# EAGLE design interface (EAGLE 7.5.0)
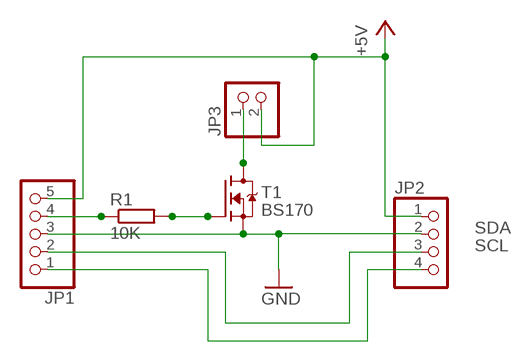
[diagram p0: schematic, sheet 1]

## Parts
JP1  PINHD-1X5  [1X05]
JP2  PINHD-1X4  [1X04]
JP3  PINHD-1X2  [1X02]
R1  10K  R-EU_R0805  [R0805]
T1  BS170  MOSFET-N-SOT23  [SOT23]

## Nets
+5V: JP1.5 JP2.1 JP3.2
GND: JP1.3 JP2.2 T1.2(S)
N$1: JP1.4 R1.1
N$2: R1.2 T1.1(G)
N$3: JP3.1 T1.3(D)
N$6: JP1.2 JP2.3
N$7: JP1.1 JP2.4

## Notes on the sheet
- SDA
- SCL

## Library data of the parts
JP1 = pinhead:PINHD-1X5: PIN HEADER
JP2 = pinhead:PINHD-1X4: PIN HEADER
JP3 = pinhead:PINHD-1X2: PIN HEADER
R1 = rcl:R-EU_: RESISTOR, European symbol
T1 = we-transistor:MOSFET-N: N-Channel MOSFET SOT23 N-Chn MOSFET TSM3404, IRLML2502 (Vgs>=+/-20V, Vds<=20V, Id>=3A + Rds<=0.05Ohm @ Vgs=4.5V) BSS138 (Vgs>=+/-20V, Vds<=40V, Id>=0.2A + Rds<=3Ohm @ Vgs=4.5V) SOT223 Low Side Switch with Protection (Infineon) BSP76 (Vin=0...10V, Vds<=42V, Id=1.4A + Rds=0.2Ohm @ Vin=5V) BSP77 (Vin=0...10V, Vds<=42V, Id=2.2A + Rds=0.1Ohm @ Vin=5V) D²Pak Low Side Switch with Protection (Infineon) BTS117TC (Vin=0...10V, Vds<=60V, Id=3.5A + Rds=0.12Ohm @ Vin=5V) BTS133TC (Vin=0...10V, Vds<=60V, Id=7A + Rds=0.06Ohm @ Vin=5V) BTS141TC (Vin=0...10V, Vds<=60V, Id=12A + Rds=0.03Ohm @ Vin=5V) BTS3018TC (Vin=0...10V, Vds<=60V, Id=6A + Rds=0.02Ohm @ Vin=5V)

## Board
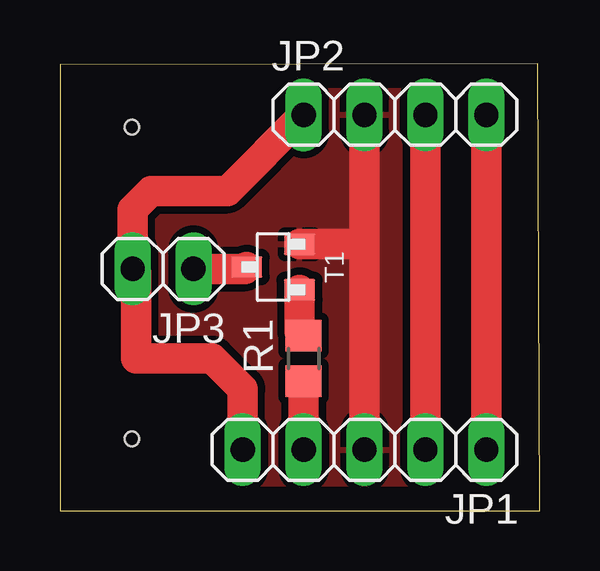
[diagram p1: board, top side]

Size 20 x 18.65 mm. Coordinates in mm from the lower left corner, seen from the top.
Outline: 0,0 20,0 19.92,18.65 0,18.6 0,0
Copper layers (1*16): Top 0.035mm / dielectric 1.5mm / Bottom 0.035mm
Design rules "default *": minimum track width 10mil, minimum drill 24mil, track to track 12mil, track to pad 12mil, pad to pad 12mil, via to via 12mil, smd to smd 8mil, copper to edge 40mil, drill to drill 8mil, minimum pad ring 10mil, minimum via ring 8mil, stop-mask expansion 4mil, vias tented up to drill 0mil, thermal gap 10mil
Holes 0.6 mm at 3,16 3,3

### Footprints (pad centres in the part's own frame; a part is rotated, then mirrored left to right if it is on the bottom)
1X05 = drill 1.016 long: 1 -5.08,0; 2 -2.54,0; 3 0,0; 4 2.54,0; 5 5.08,0
1X04 = drill 1.016 long: 1 -3.81,0; 2 -1.27,0; 3 1.27,0; 4 3.81,0
1X02 = drill 1.016 long: 1 -1.27,0; 2 1.27,0
R0805 = smd 1.3 x 1.5: 1 -0.95,0; 2 0.95,0
SOT23 = smd 1.3 x 0.9: 1 -1.1,0.95; 2 -1.1,-0.95; 3 1.1,0

### Placement (x,y rotation side)
JP1  12.7,2.54 180 top
JP2  13.97,16.51 0 top
JP3  4.3,10.08 180 top
R1  10.16,6.35 90 top
T1  8.89,10.16 180 top

### Tracks (layer width: path | path; a pad name or v marks a point on that pad's centre or on a via)
+5V
  Top 1.27: JP1.5 7.62,5.08 6.35,6.35 3.17,6.35 3.17,9.94 JP3.2 3.03,12.55 3.81,13.34 6.99,13.34 JP2.1
GND
  Top 1.27: JP1.3 12.7,11.43 | 12.7,11.43 JP2.2 | T1.2 12.38,11.11 12.7,11.43
  pour Top: 0,0 0,18.41 19.68,18.41 20.32,18.41 20.32,0
N$1
  Top 1.27: R1.1 JP1.4
N$2
  Top 1.27: T1.1 9.99,7.47 R1.2
N$3
  Top 1.27: JP3.1 7.71,10.08 T1.3
N$6
  Top 1.27: JP1.2 JP2.3
N$7
  Top 1.27: JP1.1 JP2.4